# Altium schematic sheet Sheet.SchDoc
size A4
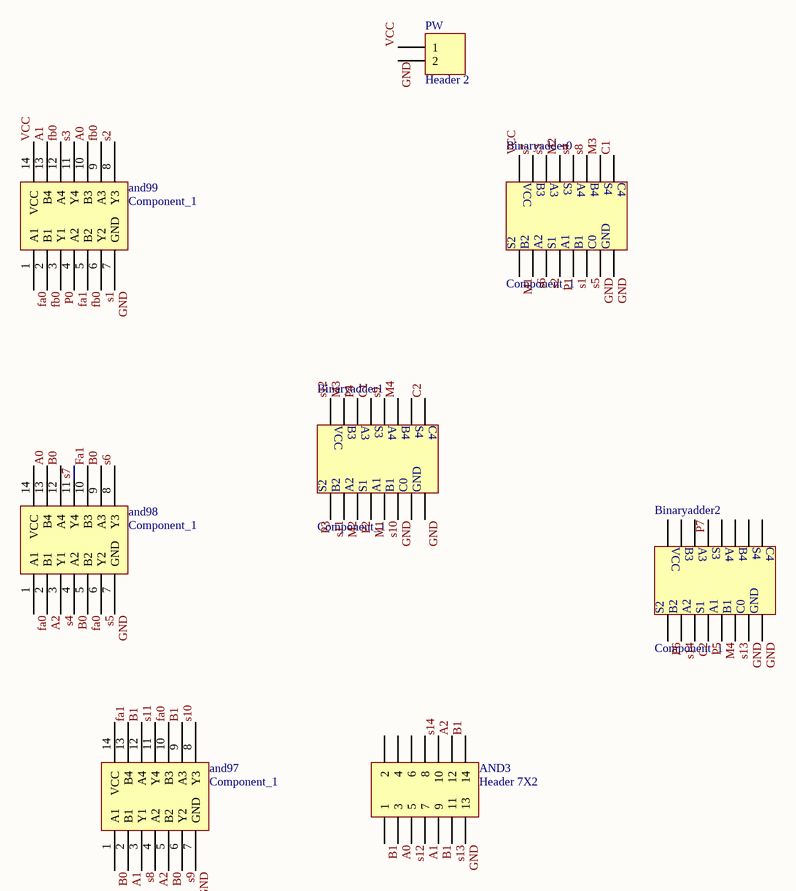
[diagram p0: Sheet.SchDoc]

## Parts
AND3  Header 7X2  [HDR2X7]
and97  Component_1  [PCBComponent_1]
and98  Component_1  [PCBComponent_1]
and99  Component_1  [PCBComponent_1]
Binaryadder0  Component_1  [PCBComponent_1]
Binaryadder1  Component_1  [PCBComponent_1]
Binaryadder2  Component_1  [PCBComponent_1]
PW  Header 2  [HDR1X2]

## Nets
A0: AND3.3 and98.13(B4) and99.10(B3)
A1: AND3.7 and97.2(B1) and99.13(B4)
A2: AND3.12 and97.4(A2) and98.2(B1)
B0: and97.1(A1) and97.5(B2) and98.4(A2) and98.9(A3) and98.12(A4)
B1: AND3.1 AND3.9 AND3.14 and97.9(A3) and97.12(A4)
fa0: and97.10(B3) and98.1(A1) and98.5(B2) and99.1(A1)
fa1: and97.13(B4) and98.10(B3) and99.4(A2)
fb0: and99.2(B1) and99.5(B2) and99.9(A3) and99.12(A4)
GND: AND3.13 and97.7(GND) and98.7(GND) and99.7(GND) PW.2
P0: and99.3(Y1)
s1: and99.6(Y2)
s2: and99.8(Y3)
s3: and99.11(Y4)
s4: and98.3(Y1)
s5: and98.6(Y2)
s6: and98.8(Y3)
s7: and98.11(Y4)
s8: and97.3(Y1)
s9: and97.6(Y2)
s10: and97.8(Y3)
s11: and97.11(Y4)
s12: AND3.5
s13: AND3.11
s14: AND3.10
VCC: and99.14(VCC) PW.1

Not connected (* = marked no-connect by the designer): AND3 2 4 6 8; and97 14(VCC); and98 14(VCC)

## Notes on the sheet
- Labels drawn without touching a wire or pin: C1, C2, GND, M1, M2, M3, M4, P1, P2, P3, P4, P5, P6, P7, s1, s2, s3, s4, s5, s6, s7, s8, s9, s10, s11, s12, s13, s14, VCC
- (in symbol Component_1) VCC; B3; A3; S3; A4; B4; S4; C4; S2; B2; A2; S1; A1; B1; C0; GND

## Library data of the parts
AND3 = Header 7X2: Header, 7-Pin, Dual row; LatestRevisionDate: 17-Jul-2002; LatestRevisionNote: Re-released for DXP Platform.; Publisher: Altium Limited
PW = Header 2: Header, 2-Pin; LatestRevisionDate: 17-Jul-2002; LatestRevisionNote: Re-released for DXP Platform.; Publisher: Altium Limited